# Altium schematic sheet GroundPins.SchDoc
size A4; CompanyName: Technische Hochschule Nürnberg Georg Simon Ohm; Address1: Fürther Straße 250; Address2: 90429 Nürnberg; Address3: GERMANY; SheetNumber: 21; SheetTotal: 21; CompanyName2: Institut ELSYS
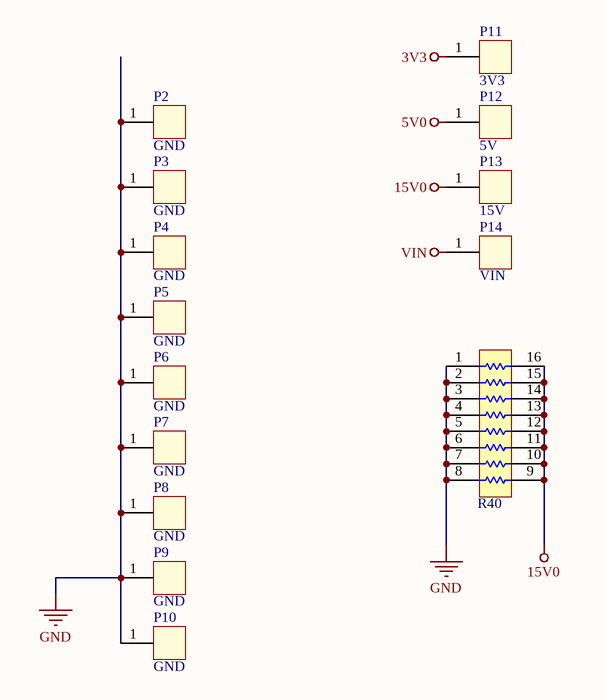
[diagram p0: GroundPins.SchDoc]

## Parts
P2  GND  [PinHeader1]
P3  GND  [PinHeader1]
P4  GND  [PinHeader1]
P5  GND  [PinHeader1]
P6  GND  [PinHeader1]
P7  GND  [PinHeader1]
P8  GND  [PinHeader1]
P9  GND  [PinHeader1]
P10  GND  [PinHeader1]
P11  3V3  [PinHeader1]
P12  5V  [PinHeader1]
P13  15V  [PinHeader1]
P14  VIN  [PinHeader1]
R40  0.063W  [RESCAXE-50P380X160X45-16N]  (value not drawn)

## Nets
3V3: P11.1
5V0: P12.1
15V0: P13.1 R40.9 R40.10 R40.11 R40.12 R40.13 R40.14 R40.15 R40.16
GND: P2.1 P3.1 P4.1 P5.1 P6.1 P7.1 P8.1 P9.1 P10.1 R40.1 R40.2 R40.3 R40.4 R40.5 R40.6 R40.7 R40.8
VIN: P14.1

## Notes on the sheet
- Title
- Size:
- Date:
- A4
- Revision:
- Time:
- Sheet
- of
- Author:
- Project:

## Library data of the parts
P2-P14 = PinHeader1: Pin Header with 1 terminal; Created: 2020-01-08_Thilo_Wendt
  P2-P10: Net: GND
  P11: Net: 3V3
  P12: Net: 5V
  P13: Net: 15V
  P14: Net: VIN
R40 = 8xR-Array_1_part: Standard thick film resistor array with 8 resistors; Manufacturer1: Panasonic; MPN1: EXB2HV<2dig_res+#zeros><tol/jumper>V; Parameter1: V; Parameter1Desc: Package Method; Parameter2: J; Parameter2Desc: Tolerance Symbol; MaxVoltage: 100; Created: 2020-01-03_Thilo_Wendt; Supplier1: https://de.farnell.com/w/search?range=inc-in-stock&st=exb2hv; Package: RESCAXE-50P380X160X45-16N; HelpURL: https://www.mouser.de/datasheet/2/315/AOC0000C14-1108062.pdf; Parameter3: *; Parameter3Desc: *; ComponentLink1Description: Datasheet; ComponentLink1URL: https://www.mouser.de/datasheet/2/315/AOC0000C14-1108062.pdf; ComponentLink2Description: Landpattern; ComponentLink2URL: https://industrial.panasonic.com/cdbs/www-data/pdf/AOC0000/AOC0000COL4.pdf